# EAGLE design Adafruit Si7021 Original (EAGLE 6.4)
COMPANY: ADAFRUIT INDUSTRIES; DRAWN: KTOWN; REV: A
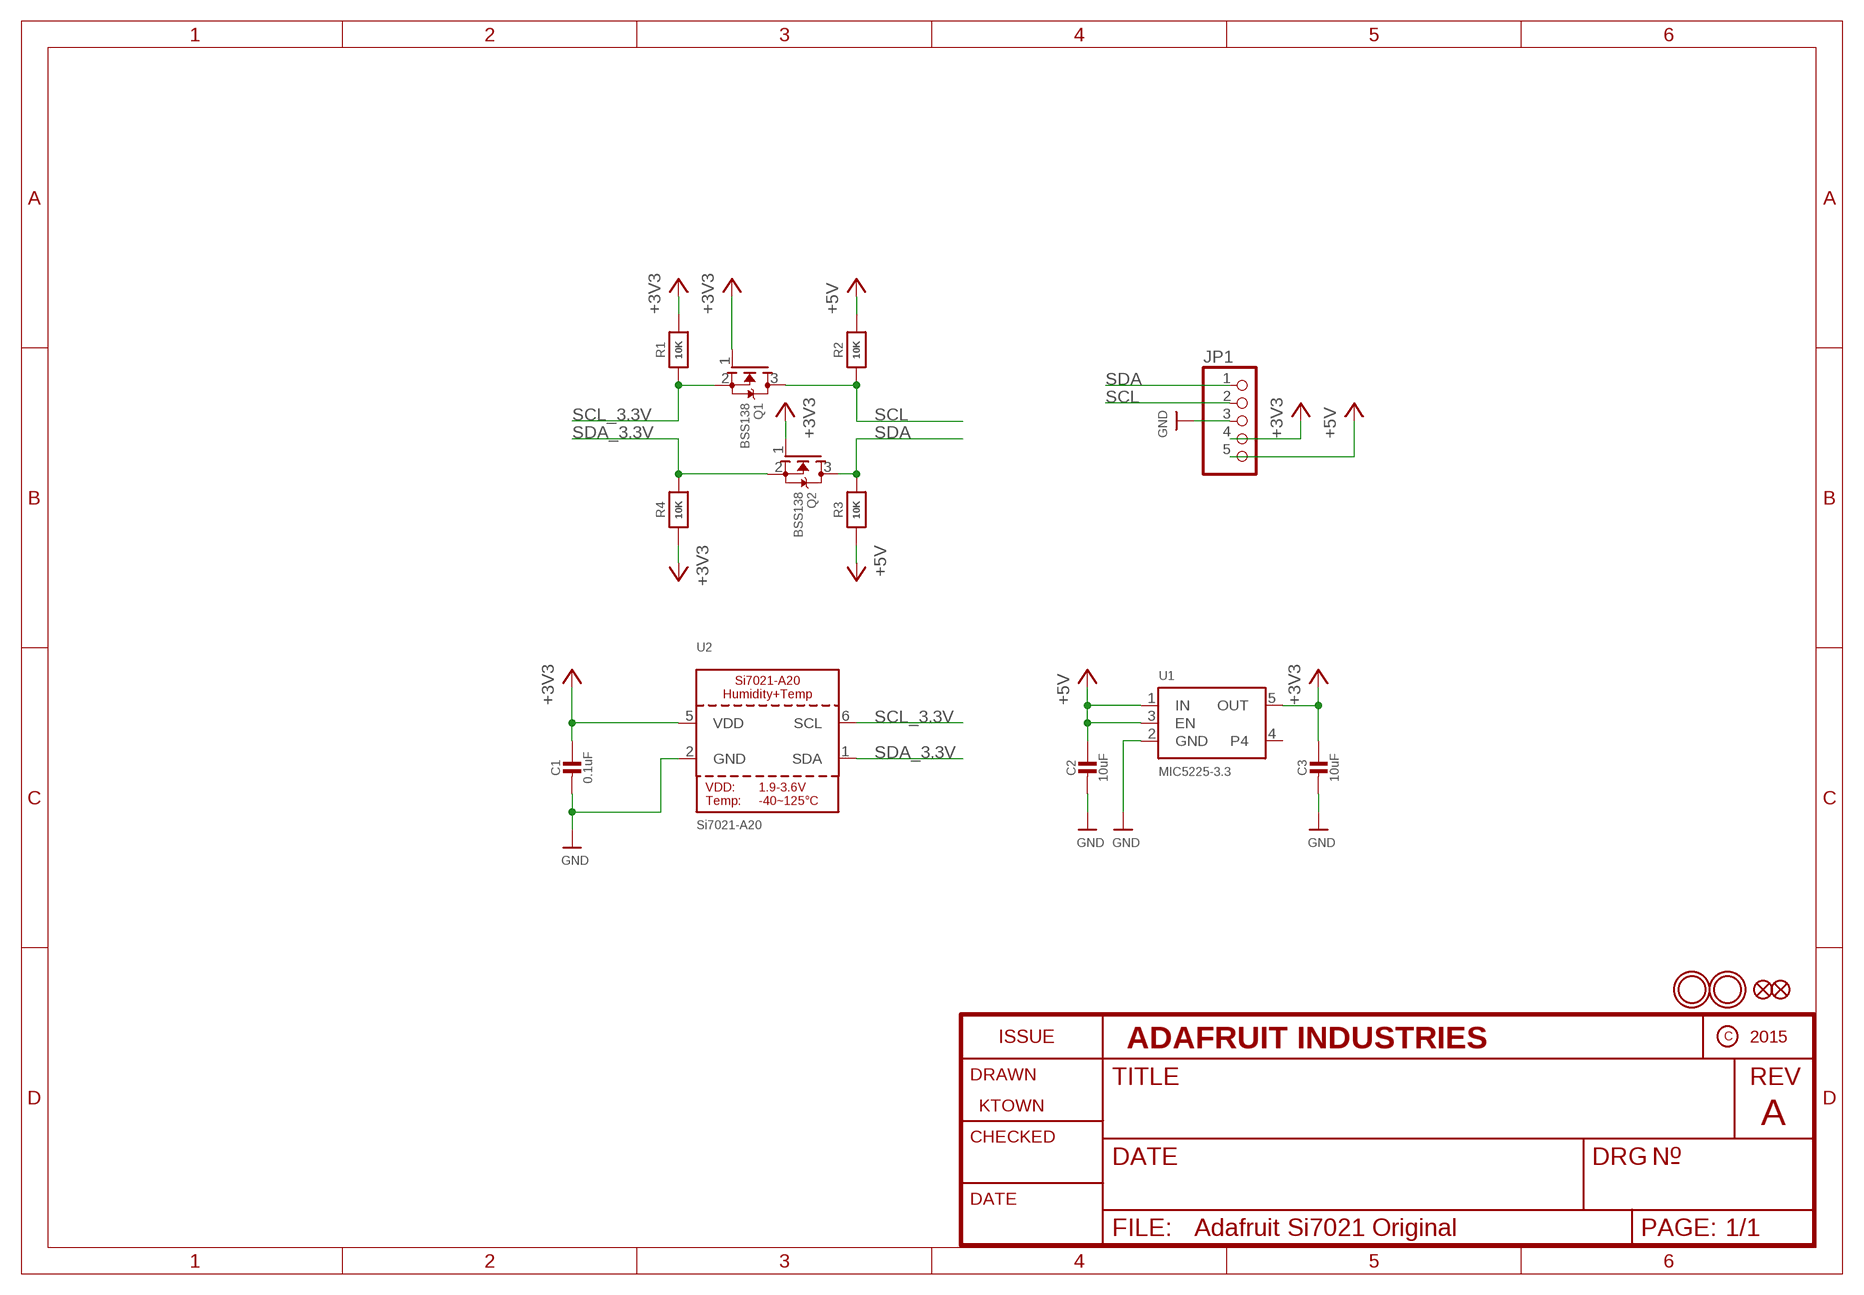
[diagram p0: schematic, sheet 1]

## Parts
C1  0.1uF  CAP_CERAMIC0805-NOOUTLINE  [0805-NO]
C2  10uF  CAP_CERAMIC0805-NOOUTLINE  [0805-NO]
C3  10uF  CAP_CERAMIC0805-NOOUTLINE  [0805-NO]
FID1  FIDUCIAL""  [FIDUCIAL_1MM]
FID2  FIDUCIAL""  [FIDUCIAL_1MM]
JP1  HEADER-1X570MIL  [1X05_ROUND_70]
Q1  BSS138  MOSFET-NWIDE  [SOT23-WIDE]
Q2  BSS138  MOSFET-NWIDE  [SOT23-WIDE]
R1  10K  RESISTOR0805_NOOUTLINE  [0805-NO]
R2  10K  RESISTOR0805_NOOUTLINE  [0805-NO]
R3  10K  RESISTOR0805_NOOUTLINE  [0805-NO]
R4  10K  RESISTOR0805_NOOUTLINE  [0805-NO]
U1  MIC5225-3.3  VREG_SOT23-5  [SOT23-5]
U2  Si7021-A20  SI7021-A20  [DFN6_3X3_SI]
U$6  MOUNTINGHOLE2.5  [MOUNTINGHOLE_2.5_PLATED]
U$7  MOUNTINGHOLE2.5  [MOUNTINGHOLE_2.5_PLATED]

## Nets
+3V3: C1.1 C3.1 JP1.4 Q1.1(G) Q2.1(G) R1.2 R4.1 U1.5(OUT) U2.5(VDD)
GND: C1.2 C2.2 C3.2 JP1.3 U1.2(GND) U2.2(GND)
SCL: JP1.2 Q1.3(D) R2.1
SCL_3.3V: Q1.2(S) R1.1 U2.6(SCL)
SDA: JP1.1 Q2.3(D) R3.2
SDA_3.3V: Q2.2(S) R4.2 U2.1(SDA)
VIN: C2.1 JP1.5 R2.2 R3.1 U1.1(IN) U1.3(EN) ; supply symbol labelled +5V
Unconnected: U1.4

## Library data of the parts
C1-C3 = microbuilder:CAP_CERAMIC: Ceramic Capacitors For new designs, use the packages preceded by an '_' character since they are more reliable: The following footprints should be used on most boards: _0402 - Standard footprint for regular board layouts _0603 - Standard footprint for regular board layouts _0805 - Standard footprint for regular board layouts _1206 - Standard footprint for regular board layouts For extremely tight-pitch boards where space is at a premium, the following 'micro-pitch' footprints can be used (smaller pads, no silkscreen outline, etc.): _0402MP - Micro-pitch footprint for very dense/compact boards _0603MP - Micro-pitch footprint for very dense/compact boards _0805MP - Micro-pitch footprint for very dense/compact boards _1206MP - Micro-pitch footprint for very dense/compact boards
FID1 FID2 = microbuilder:FIDUCIAL: Fiducial Alignment Points Various fiducial points for machine vision alignment.; BOM: EXCLUDE
JP1 = microbuilder:HEADER-1X5: PIN HEADER
Q1 Q2 = microbuilder:MOSFET-N: N-Channel Mosfet LEGEND VDS: Voltage Drain-Source ID: Drain Current RDS(ON): Drain-Source On-State Resistance VGS(TH): Gate-Source Threshold Voltage CISS: Drain-Source Input Capacitance SOT-23 Name VDS ID RDS(ON) VGS(TH) CISS Order Number 2N7002E 60V 260mA 2.5 Ohm 2.5V @ 250uA 26.7pF @ 25V 2N7002ET1GOSTR-ND BSH103 30V 850mA 400 mOhm 400mV @ 1mA 83pF @ 24V BSH103,235-ND BSS138 60V 320mA 1.6 Ohm 1.5V @ 250uA 50pF @ 10V Mouser: 771-BSS138PW115 DMN2075U-7 20V 4.2A 38 mOhm 1V @ 250 uA 594.3pF @ 10V DMN2075U-7DICT-ND * BSS138 good choice for I2C level-shifting POWERPAK 1212-8 Name VDS ID RDS(ON) VGS(TH) CISS Order Number Si7308DN 60V 6A 58 mOhm 3V @ 250uA 665pF @ 15V SI7308DN-T1-E3CT-ND
R1-R4 = microbuilder:RESISTOR: Resistors For new designs, use the packages preceded by an '_' character since they are more reliable: The following footprints should be used on most boards: _0402 - Standard footprint for regular board layouts _0603 - Standard footprint for regular board layouts _0805 - Standard footprint for regular board layouts _1206 - Standard footprint for regular board layouts For extremely tight-pitch boards where space is at a premium, the following 'micro-pitch' footprints can be used (smaller pads, no silkscreen outline, etc.): _0402MP - Micro-pitch footprint for very dense/compact boards _0603MP - Micro-pitch footprint for very dense/compact boards _0805MP - Micro-pitch footprint for very dense/compact boards _1206MP - Micro-pitch footprint for very dense/compact boards
U1 = microbuilder:VREG_SOT23-5: SOT23-5 Fixed Voltage Regulators Part Current Out V Out V In V Dropout θJA (°C/W) TJ (°C) Digikey Part No. ADP121 150mA 3.3V 3.4-5.5V 0.09V @ 150mA -- -- ADP121-AUJZ33R7CT-ND ADP121 150mA 3.0V 3.1-5.5V 0.09V @ 150mA -- -- ADP121-AUJZ30R7CT-ND ADP122 300mA 3.3V 3.4-5.5V 0.085V @ 300mA -- -- ADP122AUJZ-3.3-R7CT-ND ADP1712 300mA 3.3V 3.5-5.5V 0.17V @ 300mA -- -- ADP1712AUJZ-3.3-R7TR-ND AP7311 (Low Cost) 150mA 3.3V 3.5-6V 0.15V @ 150mA -- -- AP7311-33WG-7DICT-ND LD39015M18R 150mA 1.8V 1.9V-5.5V 0.08V @ 100mA -- -- 497-6977-1-ND LP2985A-33DBVR 150mA 3.3V 3.3-16V 0.28V @ 150mA 206 150 296-18479-1-ND MCP1824T-3302E/OT 300mA 3.3V 3.5V-6V 0.2V @ 300mA -- -- MCP1824T-3302E/OTCT-ND MIC5205-2.5YM5 TR 150mA 2.5V 2.7-16V 0.165V @ 150mA -- -- 576-1257-2-ND MIC5205-3.0YM5 TR 150mA 3.0V 3.2V-16V 0.165V @ 150mA -- -- 576-1258-2-ND MIC5205-3.3YM5 TR 150mA 3.3V 3.5V-16V 0.165V @ 150mA -- -- 576-1259-2-ND TPS780330220 150mA 3.3V+2.2V 3.6-5.5V 250mV Max -- -- 296-23332-1-ND TDA3663/N1,135 100mA 3.3V 3.5-45V 0.18V @ 50mA -- -- 568-5343-1-ND Max operating temp can be calculated using θJA, TJ (max junction temperature), and power in watts. Set the "Maximum Ambient Temperature" until it reaches TJ ("Max Junction Temperature"), which is the absolute limit for safe use of the regulator: Heat Sink Temperature Calculator <http://www.daycounter.com/Calculators/Heat-Sink-Temperature-Calculator.phtml> For example, With 12V source into a 3.3V LP2985 and a 30mA load, we are dissipating (12V-3.3V) * 0.03A = 0.261W. With a θJA of 206 °C/W, a TJ of 150°C, and 261mW we can safely use the chip without a heat sink up to 75°C (=147.1°C Junction Temperature).
U2 = microbuilder:SI7021-A20: Si7021-A20 - I2C Humidity and Temperature Sensor VDD: 1.9-3.6V Operating Temperature: -40~125°C +/-3% RH (max) 0..80% RH Humidity Sensor +/-0.4°C (max-, -10~85°C Temperature Sensor 150uA Active, 60nA Standby
U$6 U$7 = microbuilder:MOUNTINGHOLE: Mounting Hole For #2 screws (0.086"/2.18mm width, 0.094"/2.4mm hole) use 2.5mm; BOM: EXCLUDE

## Board
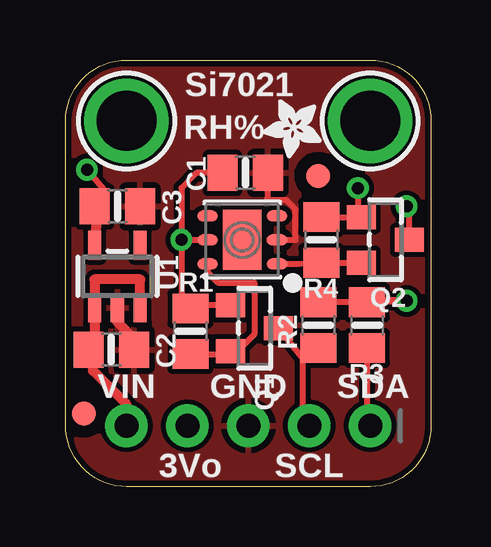
[diagram p1: board, top side]
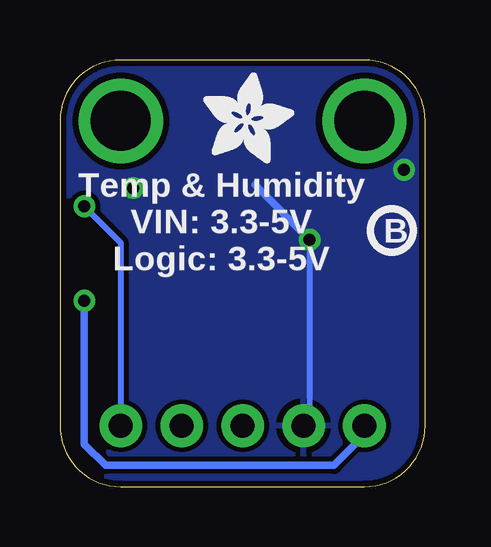
[diagram p2: board, bottom side, seen from below]

Size 15.24 x 17.78 mm. Coordinates in mm from the lower left corner, seen from the top.
Outline: 0,2.54 0,15.24 arc-90 2.54,17.78 12.7,17.78 arc-90 15.24,15.24 15.24,2.54 arc-90 12.7,0 2.54,0 arc-90 0,2.54
Copper layers (1*16): Top 0.035mm / dielectric 1.5mm / Bottom 0.035mm
Design rules "adafruit": minimum track width 8mil, minimum drill 15.5mil, track to track 8mil, track to pad 8mil, pad to pad 8mil, via to via 8mil, smd to smd 8mil, copper to edge 10mil, drill to drill 8mil, minimum pad ring 10mil, minimum via ring 8mil, stop-mask expansion 2mil, vias tented up to drill 20mil, thermal gap 10mil

### Footprints (pad centres in the part's own frame; a part is rotated, then mirrored left to right if it is on the bottom)
0805-NO = smd 1.24 x 1.5: 1 -0.95,0; 2 0.95,0
FIDUCIAL_1MM = smd 1 x 1: 1 0,0
1X05_ROUND_70 = drill 1 pad 1.778: 1 -5.08,0; 2 -2.54,0; 3 0,0; 4 2.54,0; 5 5.08,0
SOT23-WIDE = smd 1 x 1.2: 1 -0.95,-1; 2 0.95,-1; 3 0,1
SOT23-5 = smd 0.55 x 1.2: 1 -0.95,-1.3; 2 0,-1.3; 3 0.95,-1.3; 4 0.95,1.3; 5 -0.95,1.3
DFN6_3X3_SI = smd 0.85 x 0.45: 1 -1.45,1; 2 -1.45,0; 3 -1.45,-1; 4 1.45,-1; 5 1.45,0; 6 1.45,1 | smd 1.6 x 2.5: P$1 0,0
MOUNTINGHOLE_2.5_PLATED = drill 2.5 pad 3.2: P$1 0,0

### Placement (x,y rotation side)
C1  7.49,13.08 0 top
C2  1.91,5.71 0 top
C3  2.16,11.68 0 top
FID1  0.76,3.05 0 top
FID2  10.54,12.95 0 top
JP1  7.62,2.54 180 top
Q1  7.87,6.6 270 top
Q2  13.34,10.29 270 top
R1  5.21,6.48 90 top
R2  10.54,6.73 90 top
R3  12.57,6.73 270 top
R4  10.67,10.29 270 top
U1  2.16,8.76 0 top
U2  7.37,10.29 180 top
U$1  [ADAFRUIT_2.5MM]  10.67,16.13 180 top
U$6  12.7,15.24 0 top
U$7  2.54,15.24 0 top
U$9  [PCBFEAT-REV-040]  1.4,10.67 0 bottom
U$10  [ADAFRUIT_3.5MM]  9.27,13.46 0 bottom

### Tracks (layer width: path | path; a pad name or v marks a point on that pad's centre or on a via)
+3V3  (via drill 0.5)
  Top 0.254: Q1.1 5.33,7.55 | 5.33,7.55 R1.2 4.89,7.43 | R4.1 Q2.1 12.19,11.38 v12.19,12.45 | C1.1 5.46,13.08 4.83,12.45 v4.83,10.29 | v4.83,10.29 U2.5 | v4.83,10.29 4.83,7.55 5.33,7.55 | C3.1 1.72,12.25 v0.89,13.21
  Top 0.305: 6.48,13.15 C1.1
  Top 0.406: C3.1 1.34,11.81 U1.5
  Bottom 0.254: v4.83,10.29 4.83,2.79 JP1.4
  Bottom 0.305: 7.11,12.57 v4.83,10.29
  pour Bottom: 0,17.78 0,0 15.24,0 15.24,17.78
GND
  Top 0.254: U2.2 9.59,10.29 9.59,11.56 9.21,11.94 8.38,11.94 8.44,12 C1.2
  Top 0.406: U1.2 2.16,6.86 2.98,6.04 C2.2
  pour Top: 0,17.78 0,0 15.24,0 15.24,17.78
SCL
  Top 0.254: Q1.3 9.89,5.33 | JP1.2 9.89,2.81 9.89,5.33 | 9.89,5.33 9.89,5.59 10.08,5.78 R2.1
SCL_3.3V
  Top 0.254: R1.1 7,5.53 Q1.2 7.19,5.71 7.24,5.71 7.87,6.35 7.87,8.51 6.35,8.51 5.92,8.94 U2.6
SDA  (via drill 0.5)
  Top 0.254: 12.51,5.84 R3.2 12.57,2.67 JP1.1 | Q2.3 14.34,11.57 v14.22,11.68
  Bottom 0.254: v14.22,11.68 12.7,10.16 JP1.1
SDA_3.3V
  Top 0.254: Q2.2 R4.2 9.73,9.29 U2.1
VIN  (via drill 0.5)
  Top 0.254: R3.1 R2.2
  Top 0.305: v14.22,7.75 12.64,7.75 R3.1
  Top 0.406: JP1.5 2.54,3.43 1.14,4.83 1.14,5.78 C2.1 1.21,6.1 U1.1 1.21,8.64 3.11,8.64 U1.3
  Bottom 0.305: JP1.5 2.54,2.16 3.81,0.89 13.34,0.89 14.22,1.78 v14.22,7.75

### Text on the board
tPlace: Si7021 | RH% | VIN | GND | SDA | 3Vo | SCL
bPlace: Temp & Humidity / VIN: 3.3-5V / Logic: 3.3-5V